# EAGLE design dc32sao (EAGLE 9.6.2)
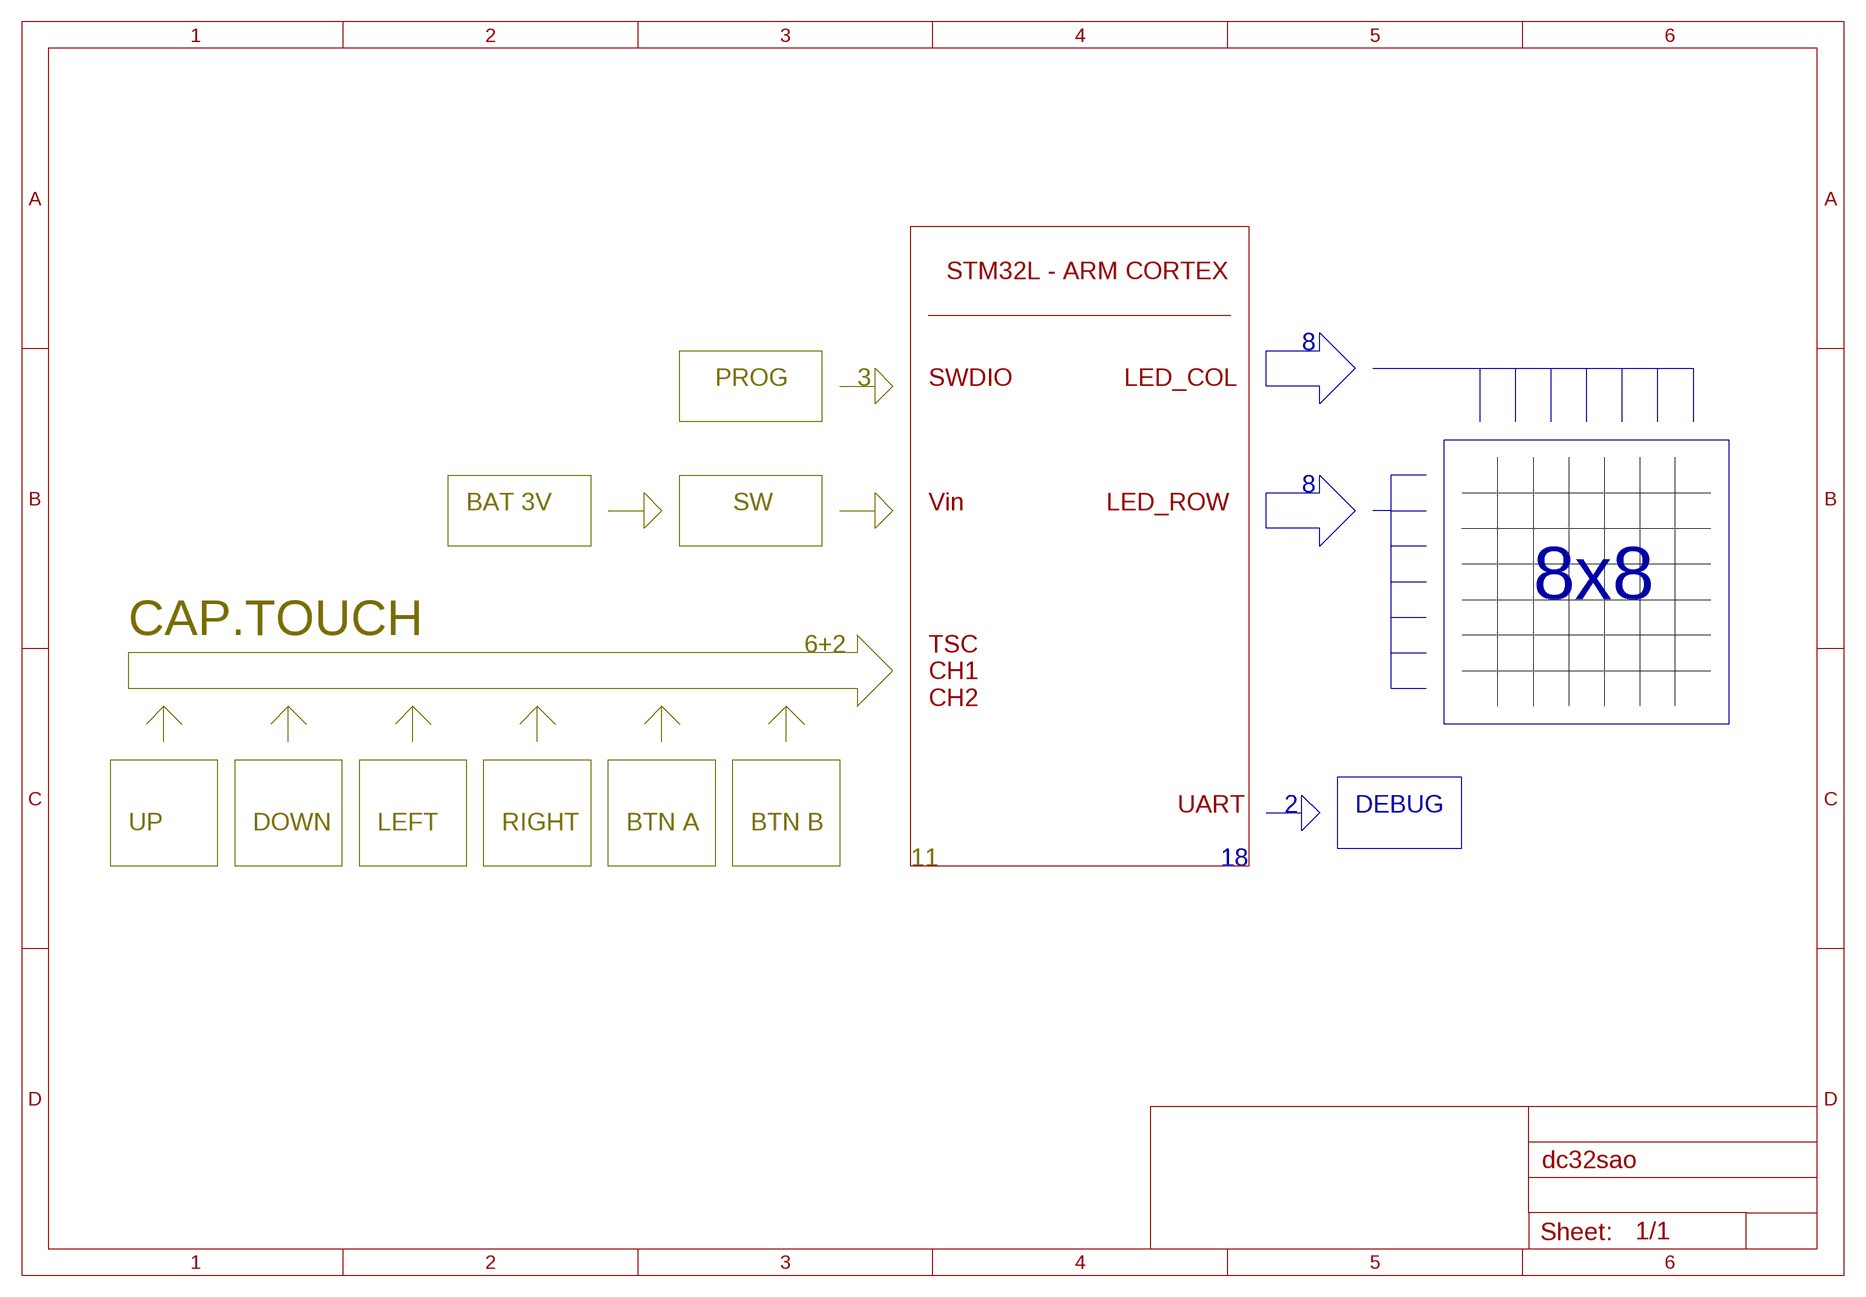
[diagram p0: schematic, sheet 1, part 1 of 2]
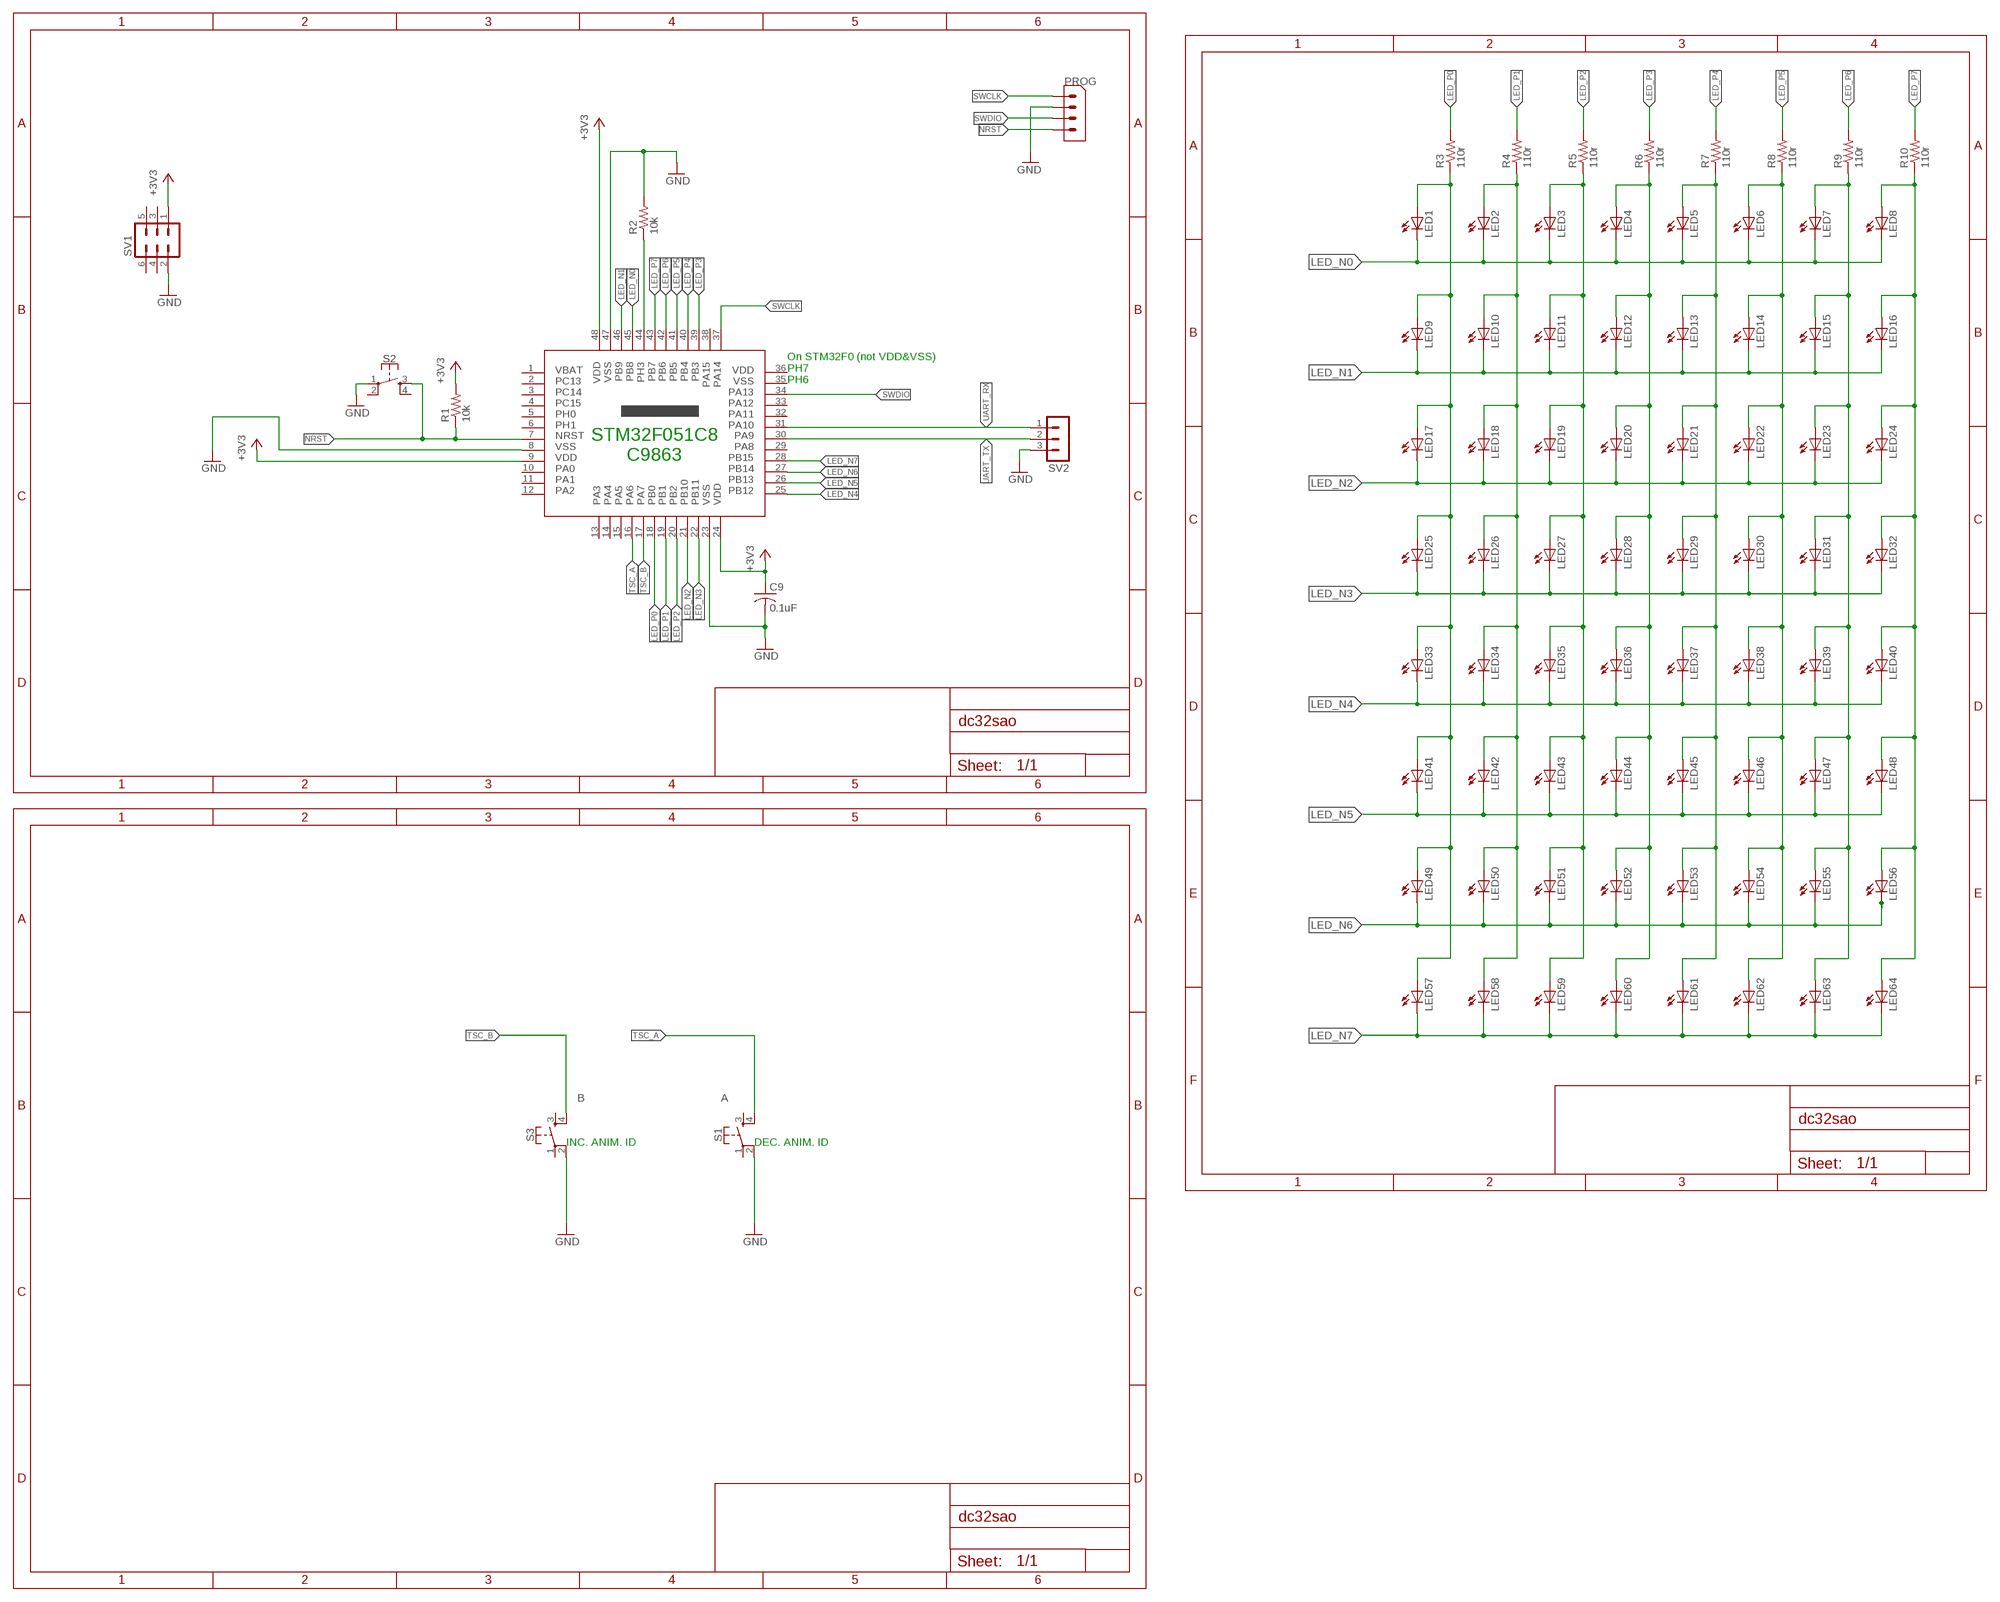
[diagram p1: schematic, sheet 1, part 2 of 2]

## Parts
C9  0.1uF  C-USC0603  [C0603]
LED1  LEDCHIP-LED0603  [CHIP-LED0603]
LED2  LEDCHIP-LED0603  [CHIP-LED0603]
LED3  LEDCHIP-LED0603  [CHIP-LED0603]
LED4  LEDCHIP-LED0603  [CHIP-LED0603]
LED5  LEDCHIP-LED0603  [CHIP-LED0603]
LED6  LEDCHIP-LED0603  [CHIP-LED0603]
LED7  LEDCHIP-LED0603  [CHIP-LED0603]
LED8  LEDCHIP-LED0603  [CHIP-LED0603]
LED9  LEDCHIP-LED0603  [CHIP-LED0603]
LED10  LEDCHIP-LED0603  [CHIP-LED0603]
LED11  LEDCHIP-LED0603  [CHIP-LED0603]
LED12  LEDCHIP-LED0603  [CHIP-LED0603]
LED13  LEDCHIP-LED0603  [CHIP-LED0603]
LED14  LEDCHIP-LED0603  [CHIP-LED0603]
LED15  LEDCHIP-LED0603  [CHIP-LED0603]
LED16  LEDCHIP-LED0603  [CHIP-LED0603]
LED17  LEDCHIP-LED0603  [CHIP-LED0603]
LED18  LEDCHIP-LED0603  [CHIP-LED0603]
LED19  LEDCHIP-LED0603  [CHIP-LED0603]
LED20  LEDCHIP-LED0603  [CHIP-LED0603]
LED21  LEDCHIP-LED0603  [CHIP-LED0603]
LED22  LEDCHIP-LED0603  [CHIP-LED0603]
LED23  LEDCHIP-LED0603  [CHIP-LED0603]
LED24  LEDCHIP-LED0603  [CHIP-LED0603]
LED25  LEDCHIP-LED0603  [CHIP-LED0603]
LED26  LEDCHIP-LED0603  [CHIP-LED0603]
LED27  LEDCHIP-LED0603  [CHIP-LED0603]
LED28  LEDCHIP-LED0603  [CHIP-LED0603]
LED29  LEDCHIP-LED0603  [CHIP-LED0603]
LED30  LEDCHIP-LED0603  [CHIP-LED0603]
LED31  LEDCHIP-LED0603  [CHIP-LED0603]
LED32  LEDCHIP-LED0603  [CHIP-LED0603]
LED33  LEDCHIP-LED0603  [CHIP-LED0603]
LED34  LEDCHIP-LED0603  [CHIP-LED0603]
LED35  LEDCHIP-LED0603  [CHIP-LED0603]
LED36  LEDCHIP-LED0603  [CHIP-LED0603]
LED37  LEDCHIP-LED0603  [CHIP-LED0603]
LED38  LEDCHIP-LED0603  [CHIP-LED0603]
LED39  LEDCHIP-LED0603  [CHIP-LED0603]
LED40  LEDCHIP-LED0603  [CHIP-LED0603]
LED41  LEDCHIP-LED0603  [CHIP-LED0603]
LED42  LEDCHIP-LED0603  [CHIP-LED0603]
LED43  LEDCHIP-LED0603  [CHIP-LED0603]
LED44  LEDCHIP-LED0603  [CHIP-LED0603]
LED45  LEDCHIP-LED0603  [CHIP-LED0603]
LED46  LEDCHIP-LED0603  [CHIP-LED0603]
LED47  LEDCHIP-LED0603  [CHIP-LED0603]
LED48  LEDCHIP-LED0603  [CHIP-LED0603]
LED49  LEDCHIP-LED0603  [CHIP-LED0603]
LED50  LEDCHIP-LED0603  [CHIP-LED0603]
LED51  LEDCHIP-LED0603  [CHIP-LED0603]
LED52  LEDCHIP-LED0603  [CHIP-LED0603]
LED53  LEDCHIP-LED0603  [CHIP-LED0603]
LED54  LEDCHIP-LED0603  [CHIP-LED0603]
LED55  LEDCHIP-LED0603  [CHIP-LED0603]
LED56  LEDCHIP-LED0603  [CHIP-LED0603]
LED57  LEDCHIP-LED0603  [CHIP-LED0603]
LED58  LEDCHIP-LED0603  [CHIP-LED0603]
LED59  LEDCHIP-LED0603  [CHIP-LED0603]
LED60  LEDCHIP-LED0603  [CHIP-LED0603]
LED61  LEDCHIP-LED0603  [CHIP-LED0603]
LED62  LEDCHIP-LED0603  [CHIP-LED0603]
LED63  LEDCHIP-LED0603  [CHIP-LED0603]
LED64  LEDCHIP-LED0603  [CHIP-LED0603]
PROG  4-PIN-1.25MM  [4-PIN-1.25MM]
R1  10k  R-US_R0603  [R0603]
R2  10k  R-US_R0603  [R0603]
R3  110r  R-US_R0603  [R0603]
R4  110r  R-US_R0603  [R0603]
R5  110r  R-US_R0603  [R0603]
R6  110r  R-US_R0603  [R0603]
R7  110r  R-US_R0603  [R0603]
R8  110r  R-US_R0603  [R0603]
R9  110r  R-US_R0603  [R0603]
R10  110r  R-US_R0603  [R0603]
S1  MOMENTARY-SWITCH-SPST-2-SMD-5.2MM  [TACTILE_SWITCH_SMD_5.2MM]
S2  MOMENTARY-SWITCH-SPST-2-SMD-5.2MM  [TACTILE_SWITCH_SMD_5.2MM]
S3  MOMENTARY-SWITCH-SPST-2-SMD-5.2MM  [TACTILE_SWITCH_SMD_5.2MM]
SV1  MA03-2  [MA03-2]
SV2  MA03-1  [MA03-1]
U$2  STM32L431CC  [QFP50P900X900X160-48]

## Nets
+3V3: C9.1 R1.2 SV1.1 U$2.9 U$2.24 U$2.48
GND: C9.2 PROG.P$3 R2.2 S1.2 S2.1 S3.2 SV1.2 SV2.3 U$2.8 U$2.23 U$2.47
LED_N0: LED1.C LED2.C LED3.C LED4.C LED5.C LED6.C LED7.C LED8.C U$2.45
LED_N1: LED9.C LED10.C LED11.C LED12.C LED13.C LED14.C LED15.C LED16.C U$2.46
LED_N2: LED17.C LED18.C LED19.C LED20.C LED21.C LED22.C LED23.C LED24.C U$2.21
LED_N3: LED25.C LED26.C LED27.C LED28.C LED29.C LED30.C LED31.C LED32.C U$2.22
LED_N4: LED33.C LED34.C LED35.C LED36.C LED37.C LED38.C LED39.C LED40.C U$2.25
LED_N5: LED41.C LED42.C LED43.C LED44.C LED45.C LED46.C LED47.C LED48.C U$2.26
LED_N6: LED49.C LED50.C LED51.C LED52.C LED53.C LED54.C LED55.C LED56.C U$2.27
LED_N7: LED57.C LED58.C LED59.C LED60.C LED61.C LED62.C LED63.C LED64.C U$2.28
LED_P0: R3.2 U$2.18
LED_P0B: LED1.A LED9.A LED17.A LED25.A LED33.A LED41.A LED49.A LED57.A R3.1
LED_P1: R4.2 U$2.19
LED_P1B: LED2.A LED10.A LED18.A LED26.A LED34.A LED42.A LED50.A LED58.A R4.1
LED_P2: R5.2 U$2.20
LED_P2B: LED3.A LED11.A LED19.A LED27.A LED35.A LED43.A LED51.A LED59.A R5.1
LED_P3: R6.2 U$2.39
LED_P3B: LED4.A LED12.A LED20.A LED28.A LED36.A LED44.A LED52.A LED60.A R6.1
LED_P4: R7.2 U$2.40
LED_P4B: LED5.A LED13.A LED21.A LED29.A LED37.A LED45.A LED53.A LED61.A R7.1
LED_P5: R8.2 U$2.41
LED_P5B: LED6.A LED14.A LED22.A LED30.A LED38.A LED46.A LED54.A LED62.A R8.1
LED_P6: R9.2 U$2.42
LED_P6B: LED7.A LED15.A LED23.A LED31.A LED39.A LED47.A LED55.A LED63.A R9.1
LED_P7: R10.2 U$2.43
LED_P7B: LED8.A LED16.A LED24.A LED32.A LED40.A LED48.A LED56.A LED64.A R10.1
N$6: R2.1 U$2.44
NRST: PROG.P$1 R1.1 S2.3 U$2.7
SWCLK: PROG.P$4 U$2.37
SWDIO: PROG.P$2 U$2.34
TSC_A: S1.4 U$2.16
TSC_B: S3.4 U$2.17
UART_RX: SV2.1 U$2.31
UART_TX: SV2.2 U$2.30
Unconnected: S1.1 S1.3 S2.2 S2.4 S3.1 S3.3 SV1.3 SV1.4 SV1.5 SV1.6 U$2.1 U$2.2 U$2.3 U$2.4 U$2.5 U$2.6 U$2.10 U$2.11 U$2.12 U$2.13 U$2.14 U$2.15 U$2.29 U$2.32 U$2.33 U$2.35 U$2.36 U$2.38

## Buses
B$1
B$2
B$3
B$4
B$5
B$7
B$6
B$8

## Notes on the sheet
- STM32L - ARM CORTEX
- 8
- PROG | 3 | SWDIO | LED_COL
- 8
- BAT 3V | SW | Vin | LED_ROW
- 8x8
- On STM32F0 (not VDD&VSS)
  PH7
  PH6
- CAP.TOUCH
- 6+2
- TSC 
  CH1
  CH2
- STM32F051C8
  C9863
- UART | 2 | DEBUG
- UP | DOWN | LEFT | RIGHT | BTN A | BTN B
- 11 | 18
- B | A
- INC. ANIM. ID | DEC. ANIM. ID

## Library data of the parts
C9 = rcl:C-US: CAPACITOR, American symbol; SPICEPREFIX: C
LED1-LED64 = adafruit:LED: LED OSRAM: - CHIPLED LG R971, LG N971, LY N971, LG Q971, LY Q971, LO R971, LY R971 LH N974, LH R974 LS Q976, LO Q976, LY Q976 LO Q996 - Hyper CHIPLED LW Q18S LB Q993, LB Q99A, LB R99A - SideLED LS A670, LO A670, LY A670, LG A670, LP A670 LB A673, LV A673, LT A673, LW A673 LH A674 LY A675 LS A676, LA A676, LO A676, LY A676, LW A676 LS A679, LY A679, LG A679 - Hyper Micro SIDELED® LS Y876, LA Y876, LO Y876, LY Y876 LT Y87S - SmartLED LW L88C, LW L88S LB L89C, LB L89S, LG L890 LS L89K, LO L89K, LY L89K LS L896, LA L896, LO L896, LY L896 - TOPLED LS T670, LO T670, LY T670, LG T670, LP T670 LSG T670, LSP T670, LSY T670, LOP T670, LYG T670 LG T671, LOG T671, LSG T671 LB T673, LV T673, LT T673, LW T673 LH T674 LS T676, LA T676, LO T676, LY T676, LB T676, LH T676, LSB T676, LW T676 LB T67C, LV T67C, LT T67C, LS T67K, LO T67K, LY T67K, LW E67C LS E67B, LA E67B, LO E67B, LY E67B, LB E67C, LV E67C, LT E67C LW T67C LS T679, LY T679, LG T679 LS T770, LO T770, LY T770, LG T770, LP T770 LB T773, LV T773, LT T773, LW T773 LH T774 LS E675, LA E675, LY E675, LS T675 LS T776, LA T776, LO T776, LY T776, LB T776 LHGB T686 LT T68C, LB T68C - Hyper Mini TOPLED® LB M676 - Mini TOPLED Santana® LG M470 LS M47K, LO M47K, LY M47K Source: http://www.osram.convergy.de/
PROG = Wingling Library:4-PIN-1.25MM
R1-R10 = rcl:R-US_: RESISTOR, American symbol; SPICEPREFIX: R
S1-S3 = SparkFun-Switches:MOMENTARY-SWITCH-SPST-2: Momentary Switch (Pushbutton) - SPST - Two Circuits Normally-open (NO) SPST momentary switches (buttons, pushbuttons). Schematic symbol includes two switch circuits. Variants SMD-4.6MMX2.8MM - 4.60mm x 2.80mm Tactile Momentary Button Switch - Used on SparkFun SAMD21 Mini Breakout <https://www.sparkfun.com/products/13664> SMD-5.2MM - Mini Pushbutton Switch - SMD <https://www.sparkfun.com/products/8720> - Used on Arduino Pro Mini <https://www.sparkfun.com/products/11114>; PROD_ID: SWCH-08247; SF_SKU: COM-08720
SV1 = con-lstb:MA03-2: PIN HEADER; OC_FARNELL: unknown; OC_NEWARK: unknown
SV2 = con-lstb:MA03-1: PIN HEADER; OC_FARNELL: unknown; OC_NEWARK: unknown
U$2 = prankbox:STM32L431CC

## Board
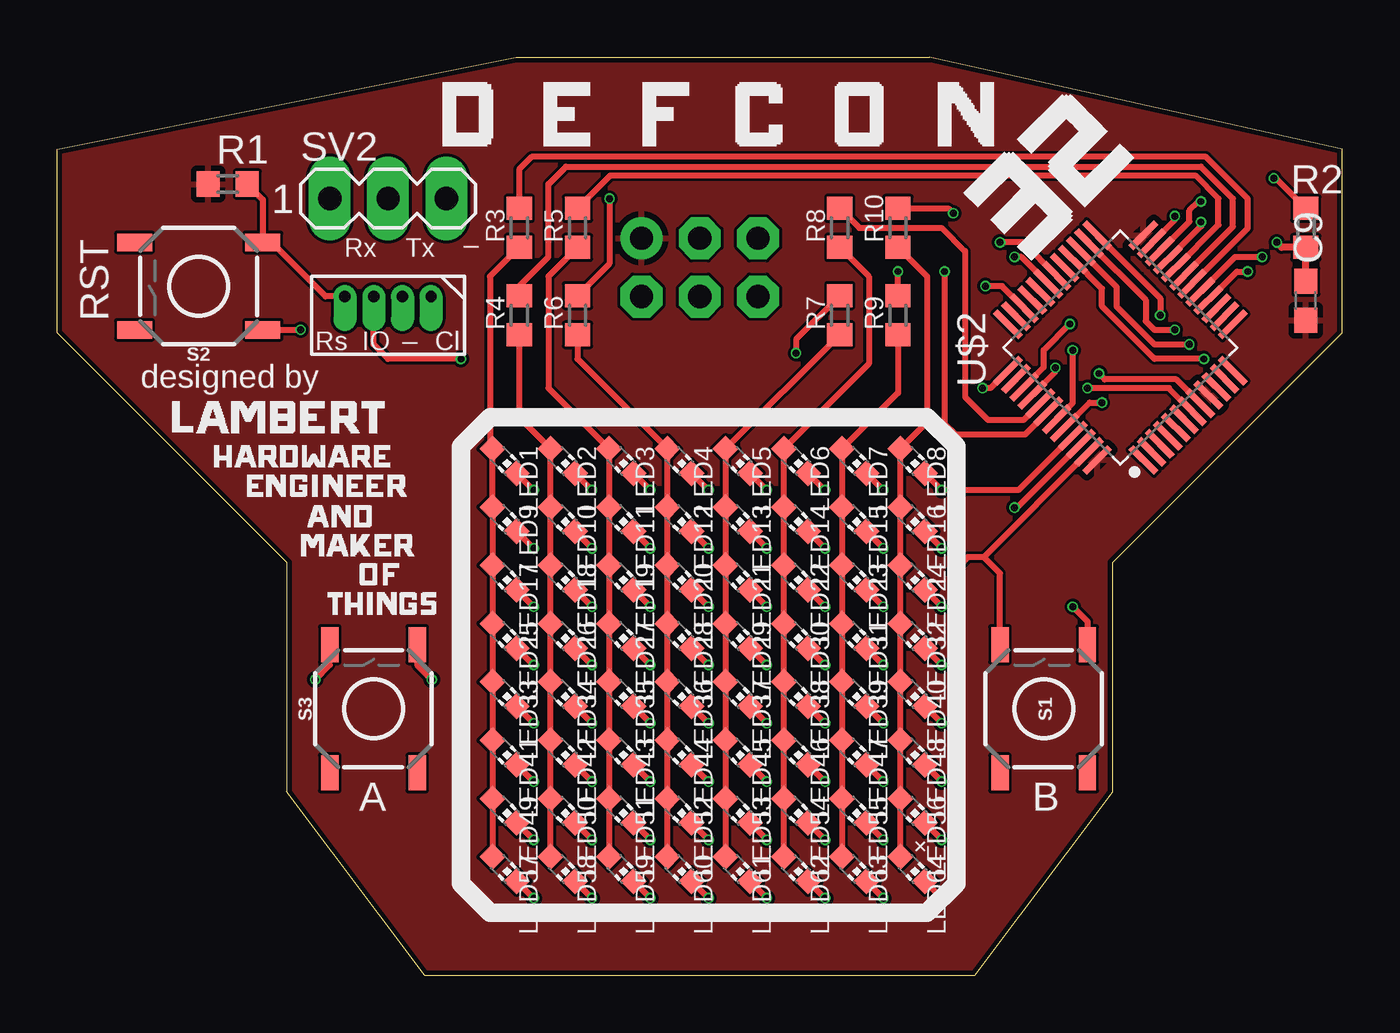
[diagram p2: board, top side]
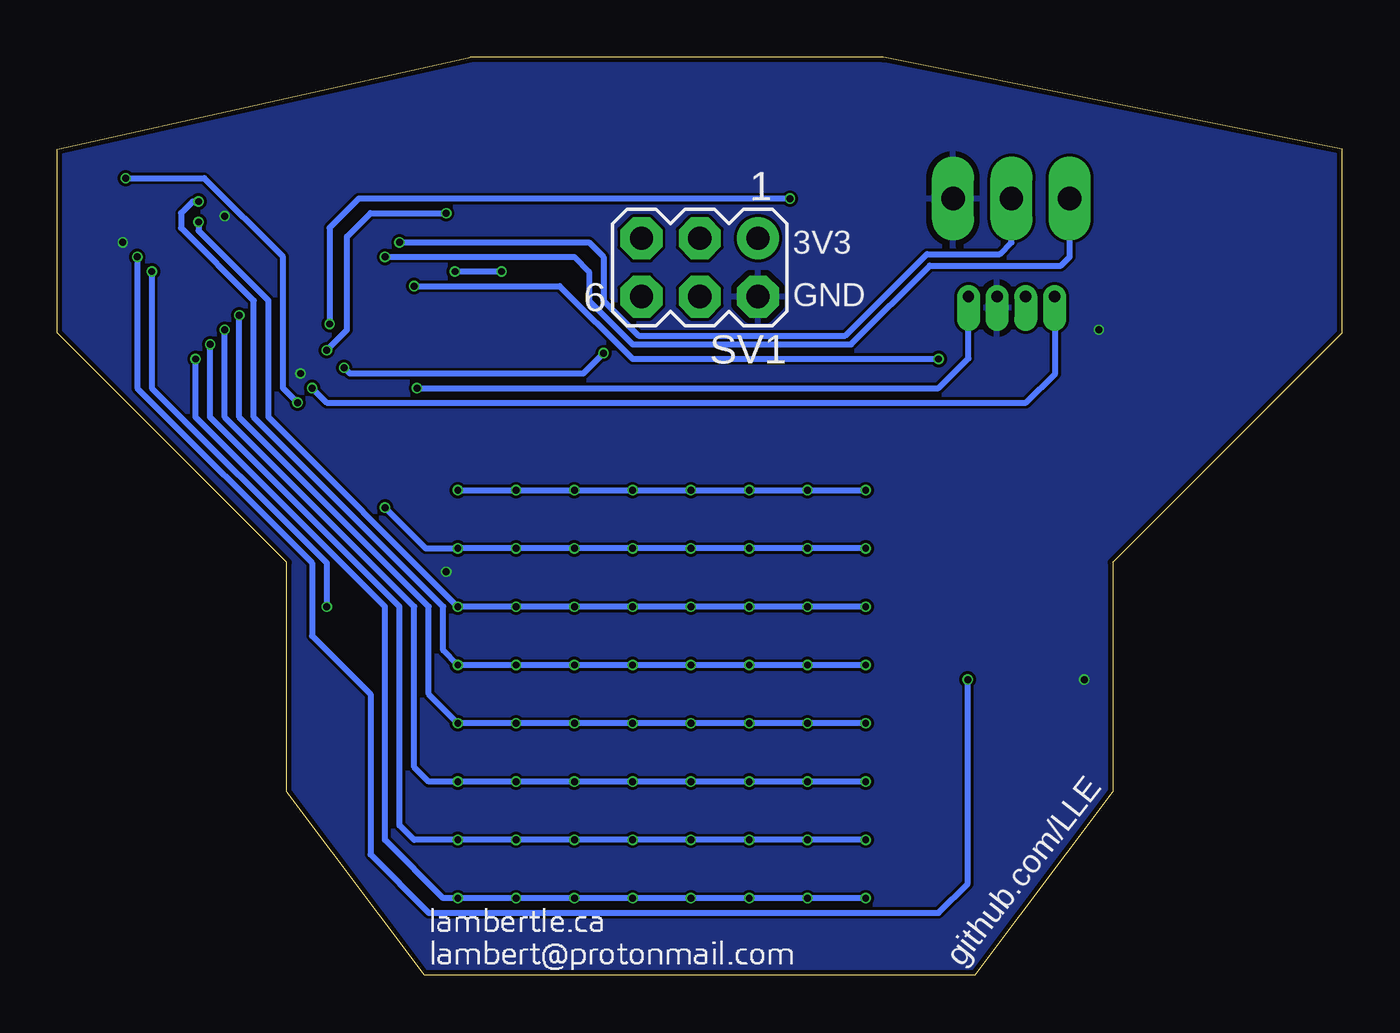
[diagram p3: board, bottom side, seen from below]

Size 56 x 40 mm. Coordinates in mm from the lower left corner, seen from the top.
Outline: 46,8 46,18 56,28 56,36 38,40 20,40 0,36 0,28 10,18 10,8 16,0 40,0 46,8
Copper layers (1*16): Top 0.035mm / dielectric 1.6mm / Bottom 0.035mm
Design rules "jlcpcb-2layers": minimum track width 5mil, minimum drill 0.3mm, track to track 5mil, track to pad 5mil, pad to pad 5mil, via to via 5mil, smd to smd 5mil, copper to edge 0.2mm, drill to drill 6mil, minimum pad ring 10mil, minimum via ring 3mil, stop-mask expansion 4mil, vias tented up to drill 0mil, thermal gap 10mil

### Footprints (pad centres in the part's own frame; a part is rotated, then mirrored left to right if it is on the bottom)
C0603 = smd 1.1 x 1: 1 -0.85,0; 2 0.85,0
CHIP-LED0603 = smd 0.8 x 0.8: A 0,-0.75; C 0,0.75
4-PIN-1.25MM = drill 0.5 offset: P$1 -1.875,0.82; P$2 -0.625,0.82; P$3 0.625,0.82; P$4 1.875,0.82
R0603 = smd 1 x 1.1: 1 -0.85,0; 2 0.85,0
TACTILE_SWITCH_SMD_5.2MM = smd 1.524 x 0.762: 1 -2.794,1.905; 2 2.794,1.905; 3 -2.794,-1.905; 4 2.794,-1.905
MA03-2 = drill 1.016: 1 -2.54,-1.27 | drill 1.016 octagon: 2 -2.54,1.27; 3 0,-1.27; 4 0,1.27; 5 2.54,-1.27; 6 2.54,1.27
MA03-1 = drill 1.016 long: 1 -2.54,0; 2 0,0; 3 2.54,0
QFP50P900X900X160-48 = smd 1.559 x 0.28: 1 -4.178,2.75; 2 -4.178,2.25; 3 -4.178,1.75; 4 -4.178,1.25; 5 -4.178,0.75; 6 -4.178,0.25; 7 -4.178,-0.25; 8 -4.178,-0.75; 9 -4.178,-1.25; 10 -4.178,-1.75; 11 -4.178,-2.25; 12 -4.178,-2.75; 25 4.178,-2.75; 26 4.178,-2.25; 27 4.178,-1.75; 28 4.178,-1.25; 29 4.178,-0.75; 30 4.178,-0.25; 31 4.178,0.25; 32 4.178,0.75; 33 4.178,1.25; 34 4.178,1.75; 35 4.178,2.25; 36 4.178,2.75 | smd 0.28 x 1.559: 13 -2.75,-4.178; 14 -2.25,-4.178; 15 -1.75,-4.178; 16 -1.25,-4.178; 17 -0.75,-4.178; 18 -0.25,-4.178; 19 0.25,-4.178; 20 0.75,-4.178; 21 1.25,-4.178; 22 1.75,-4.178; 23 2.25,-4.178; 24 2.75,-4.178; 37 2.75,4.178; 38 2.25,4.178; 39 1.75,4.178; 40 1.25,4.178; 41 0.75,4.178; 42 0.25,4.178; 43 -0.25,4.178; 44 -0.75,4.178; 45 -1.25,4.178; 46 -1.75,4.178; 47 -2.25,4.178; 48 -2.75,4.178

### Placement (x,y rotation side)
C9  54.42,29.4 90 top
LED1  19.5,22.41 225 top
LED2  22.04,22.41 225 top
LED3  24.57,22.41 225 top
LED4  27.11,22.41 225 top
LED5  29.66,22.41 225 top
LED6  32.2,22.41 225 top
LED7  34.73,22.41 225 top
LED8  37.27,22.41 225 top
LED9  19.5,19.88 225 top
LED10  22.04,19.88 225 top
LED11  24.57,19.88 225 top
LED12  27.11,19.88 225 top
LED13  29.66,19.88 225 top
LED14  32.2,19.88 225 top
LED15  34.73,19.88 225 top
LED16  37.27,19.88 225 top
LED17  19.5,17.34 225 top
LED18  22.04,17.34 225 top
LED19  24.57,17.34 225 top
LED20  27.11,17.34 225 top
LED21  29.66,17.34 225 top
LED22  32.2,17.34 225 top
LED23  34.73,17.34 225 top
LED24  37.27,17.34 225 top
LED25  19.5,14.79 225 top
LED26  22.04,14.79 225 top
LED27  24.57,14.79 225 top
LED28  27.11,14.79 225 top
LED29  29.66,14.79 225 top
LED30  32.2,14.79 225 top
LED31  34.73,14.79 225 top
LED32  37.27,14.79 225 top
LED33  19.5,12.26 225 top
LED34  22.04,12.26 225 top
LED35  24.57,12.26 225 top
LED36  27.11,12.26 225 top
LED37  29.66,12.26 225 top
LED38  32.2,12.26 225 top
LED39  34.73,12.26 225 top
LED40  37.27,12.26 225 top
LED41  19.5,9.71 225 top
LED42  22.04,9.71 225 top
LED43  24.57,9.71 225 top
LED44  27.11,9.71 225 top
LED45  29.66,9.71 225 top
LED46  32.2,9.71 225 top
LED47  34.73,9.71 225 top
LED48  37.27,9.71 225 top
LED49  19.5,7.17 225 top
LED50  22.04,7.17 225 top
LED51  24.57,7.17 225 top
LED52  27.11,7.17 225 top
LED53  29.66,7.17 225 top
LED54  32.2,7.17 225 top
LED55  34.73,7.17 225 top
LED56  37.27,7.17 225 top
LED57  19.5,4.63 225 top
LED58  22.04,4.63 225 top
LED59  24.57,4.63 225 top
LED60  27.11,4.63 225 top
LED61  29.66,4.63 225 top
LED62  32.2,4.63 225 top
LED63  34.73,4.63 225 top
LED64  37.27,4.63 225 top
PROG  14.41,28.77 0 top
R1  7.43,34.48 180 top
R2  54.42,32.58 270 top
R3  20.13,32.58 90 top
R4  20.13,28.77 90 top
R5  22.67,32.58 90 top
R6  22.67,28.77 90 top
R7  34.1,28.77 90 top
R8  34.1,32.58 90 top
R9  36.64,28.77 90 top
R10  36.64,32.58 90 top
S1  42.99,11.62 90 top
S2  6.16,30.04 180 top
S3  13.78,11.62 90 top
SV1  28,30.85 180 bottom
SV2  14.41,33.84 0 top
U$2  46.33,27.36 135 top

### Tracks (layer width: path | path; a pad name or v marks a point on that pad's centre or on a via)
+3V3
  pour Top: -4,42.1 59.5,42.1 59.5,-3.62 -4,-3.62
GND  (via drill 0.3)
  Top 0.254: S2.1 v10.61,28.13 | v11.24,12.89 11.88,13.53 S3.2 | U$2.23 48.7,32.91 v48.7,33.08 | 40.38,18.22 39.69,18.22 v39.05,17.59 | U$2.8 48.78,25.97 45.66,25.97 v45.4,26.23 | U$2.47 40.38,18.22 | S1.2 41.09,17.52 40.38,18.22 | S3.2
  Top 0.305: C9.2 R2.2 53.37,31.73 v53.15,31.94
  pour Bottom: -1.46,41.47 56.96,41.47 56.96,-1.08 -1.46,-1.08
LED_N0  (via drill 0.3)
  Top 0.254: LED8.C | LED8.C v38.55,21.14 41.89,21.14 U$2.45 | LED1.C | LED1.C v20.77,21.14 | LED2.C | LED2.C v23.3,21.14 | LED3.C v25.84,21.14 | v25.84,21.14 | LED4.C | LED4.C v28.38,21.14 | LED5.C v30.92,21.14 | v30.92,21.14 | LED6.C v33.47,21.14 | v33.47,21.14 | LED7.C | LED7.C v36.01,21.14
  Bottom 0.254: v38.55,21.14 v36.01,21.14 v33.47,21.14 v30.92,21.14 v28.38,21.14 v25.84,21.14 v23.3,21.14 v20.77,21.14
LED_N1  (via drill 0.3)
  Top 0.254: LED9.C v20.77,18.61 | v20.77,18.61 | LED10.C | LED10.C v23.3,18.61 | LED11.C v25.84,18.61 | v25.84,18.61 | LED12.C | LED12.C v28.38,18.61 | LED13.C | LED13.C v30.92,18.61 | LED14.C | LED14.C v33.47,18.61 | LED15.C | LED15.C v36.01,18.61 | LED16.C v38.55,18.61 | v38.55,18.61 | v41.72,20.38 41.83,20.38 U$2.46
  Bottom 0.254: v20.77,18.61 v23.3,18.61 v25.84,18.61 v28.38,18.61 v30.92,18.61 v33.47,18.61 v36.01,18.61 v38.55,18.61 39.94,18.61 v41.72,20.38
LED_N2  (via drill 0.3)
  Top 0.254: LED17.C v20.77,16.06 | v20.77,16.06 | U$2.21 49.85,32.64 v49.85,32.83 | LED18.C v23.3,16.06 | v23.3,16.06 | LED19.C v25.84,16.06 | v25.84,16.06 | LED20.C | LED20.C v28.38,16.06 | LED22.C | LED22.C v33.47,16.06 | LED21.C v30.92,16.06 | v30.92,16.06 | LED23.C v36.01,16.06 | v36.01,16.06 | LED24.C v38.55,16.06 | v38.55,16.06
  Bottom 0.254: v20.77,16.06 v23.3,16.06 v25.84,16.06 v28.38,16.06 v30.92,16.06 v33.47,16.06 v36.01,16.06 v38.55,16.06 46.8,24.32 46.8,29.4 49.85,32.45 v49.85,32.83
LED_N3  (via drill 0.3)
  Top 0.254: LED25.C v20.77,13.53 | v20.77,13.53 | U$2.22 49.34,32.84 49.34,33.34 49.72,33.72 v49.85,33.72 | LED26.C | LED26.C v23.3,13.53 | LED27.C v25.84,13.53 | v25.84,13.53 | LED28.C | LED28.C v28.38,13.53 | LED29.C v30.92,13.53 | v30.92,13.53 | LED31.C | LED31.C v36.01,13.53 | LED30.C | LED30.C v33.47,13.53 | LED32.C | LED32.C v38.55,13.53
  Bottom 0.254: v20.77,13.53 v23.3,13.53 v25.84,13.53 v28.38,13.53 v30.92,13.53 v33.47,13.53 v36.01,13.53 v38.55,13.53 39.18,14.16 39.18,16.06 47.44,24.32 47.44,29.4 50.61,32.58 50.61,33.21 50.1,33.72 v49.85,33.72
LED_N4  (via drill 0.3)
  Top 0.254: LED33.C v20.77,10.98 | v20.77,10.98 | U$2.25 48.07,29.51 v48.07,28.77 | LED34.C | LED34.C v23.3,10.98 | LED35.C v25.84,10.98 | v25.84,10.98 | LED36.C | LED36.C v28.38,10.98 | LED37.C | LED37.C v30.92,10.98 | LED38.C | LED38.C v33.47,10.98 | LED39.C v36.01,10.98 | v36.01,10.98 | LED40.C | LED40.C v38.55,10.98
  Bottom 0.254: v20.77,10.98 v23.3,10.98 v25.84,10.98 v28.38,10.98 v30.92,10.98 v33.47,10.98 v36.01,10.98 v38.55,10.98 39.81,12.26 39.81,16.06 48.07,24.32 v48.07,28.77
LED_N5  (via drill 0.3)
  Top 0.254: LED41.C v20.77,8.45 | v20.77,8.45 | U$2.26 47.44,29.43 47.44,28.51 47.82,28.13 v48.7,28.13 | LED48.C v38.55,8.45 | v38.55,8.45 | LED47.C | LED47.C v36.01,8.45 | LED46.C v33.47,8.45 | v33.47,8.45 | LED45.C | LED45.C v30.92,8.45 | LED44.C v28.38,8.45 | v28.38,8.45 | LED43.C v25.84,8.45 | v25.84,8.45 | LED42.C v23.3,8.45 | v23.3,8.45
  Bottom 0.254: v48.7,28.13 48.7,24.32 40.45,16.06 40.45,9.08 39.81,8.45 v38.55,8.45 v36.01,8.45 v33.47,8.45 v30.92,8.45 v28.38,8.45 v25.84,8.45 v23.3,8.45 v20.77,8.45
LED_N6  (via drill 0.3)
  Top 0.254: LED49.C | LED49.C v20.77,5.91 | U$2.27 46.16,30 46.16,29.15 47.82,27.5 v49.34,27.5 | LED50.C | LED50.C v23.3,5.91 | LED51.C | LED51.C v25.84,5.91 | LED52.C v28.38,5.91 | v28.38,5.91 | LED53.C v30.92,5.91 | v30.92,5.91 | LED54.C | LED54.C v33.47,5.91 | LED55.C v36.01,5.91 | v36.01,5.91 | LED56.C v38.55,5.91 | v38.55,5.91
  Bottom 0.254: v20.77,5.91 v23.3,5.91 v25.84,5.91 v28.38,5.91 v30.92,5.91 v33.47,5.91 v36.01,5.91 v38.55,5.91 40.45,5.91 41.09,6.54 41.09,16.06 49.34,24.32 v49.34,27.5
LED_N7  (via drill 0.3)
  Top 0.254: LED57.C v20.77,3.37 | v20.77,3.37 | v49.98,26.86 47.82,26.86 45.53,29.15 45.53,29.93 U$2.28 | LED64.C v38.55,3.37 | v38.55,3.37 | LED63.C v36.01,3.37 | v36.01,3.37 | LED62.C v33.47,3.37 | v33.47,3.37 | LED61.C | LED61.C v30.92,3.37 | LED60.C | LED60.C v28.38,3.37 | LED59.C | LED59.C v25.84,3.37 | LED58.C | LED58.C v23.3,3.37
  Bottom 0.254: v20.77,3.37 v23.3,3.37 v25.84,3.37 v28.38,3.37 v30.92,3.37 v33.47,3.37 v36.01,3.37 v38.55,3.37 39.18,3.37 41.72,5.91 41.72,16.06 49.98,24.32 v49.98,26.86
LED_P0
  Top 0.254: U$2.18 51.88,32.55 51.88,33.84 50.06,35.66 20.68,35.66 20.13,35.11 R3.2
LED_P0B
  Top 0.254: R3.1 18.86,30.45 18.86,23.05 LED1.A LED9.A 18.96,17.97 LED17.A LED25.A LED33.A LED41.A LED49.A LED57.A
LED_P1
  Top 0.254: U$2.19 51.24,32.62 51.24,33.84 49.85,35.24 22.16,35.24 21.4,34.48 21.4,31.3 20.13,30.04 R4.2
LED_P1B
  Top 0.254: R4.1 20.13,24.32 LED2.A LED10.A LED18.A LED26.A 21.5,12.89 LED34.A LED42.A LED50.A LED58.A
LED_P2
  Top 0.254: U$2.20 50.61,32.7 50.61,33.84 49.59,34.86 24.11,34.86 R5.2
LED_P2B
  Top 0.254: R5.1 21.4,30.45 21.4,25.59 LED3.A 24.05,20.51 LED11.A LED19.A LED27.A LED35.A LED43.A LED51.A LED59.A
LED_P3  (via drill 0.3)
  Top 0.254: U$2.39 42.99,26.49 42.99,27.24 v44.13,28.38 | v24.07,33.84 24.07,31.01 R6.2
  Bottom 0.254: v24.07,33.84 42.86,33.84 44.13,32.58 v44.13,28.38
LED_P3B
  Top 0.254: R6.1 22.67,26.86 LED4.A LED12.A LED20.A LED28.A 26.59,12.89 LED36.A LED44.A LED52.A LED60.A
LED_P4  (via drill 0.3)
  Top 0.254: U$2.40 43.5,26.29 v43.5,26.48 | R7.2 32.2,27.71 v32.2,27.11
  Bottom 0.254: v32.2,27.11 33.08,26.23 43.24,26.23 v43.5,26.48
LED_P4B
  Top 0.254: R7.1 LED5.A LED13.A LED21.A LED29.A LED37.A 29.12,10.35 LED45.A LED53.A LED61.A
LED_P5
  Top 0.254: U$2.41 42.11,24.19 40.58,24.19 39.56,25.21 39.56,31.56 38.55,32.58 34.95,32.58 R8.2
LED_P5B
  Top 0.254: R8.1 35.37,30.45 35.37,26.65 LED6.A LED14.A LED22.A LED30.A LED38.A LED46.A 31.66,7.81 LED54.A LED62.A
LED_P6  (via drill 0.3)
  Top 0.254: U$2.42 42.18,23.56 39.18,23.56 38.67,24.07 v38.67,30.67 | R9.2 v36.64,30.67
  Bottom 0.254: v36.64,30.67 v38.67,30.67
LED_P6B
  Top 0.254: R9.1 36.64,25.38 LED7.A 34.2,20.51 LED15.A LED23.A LED31.A LED39.A LED47.A LED55.A LED63.A
LED_P7  (via drill 0.3)
  Top 0.254: U$2.43 44.26,24.93 v44.26,27.24 | R10.2 38.84,33.42 v39.05,33.21
  Bottom 0.254: v44.26,27.24 43.37,28.13 43.37,32.19 42.35,33.21 v39.05,33.21
LED_P7B
  Top 0.254: R10.1 37.91,30.45 37.91,24.11 LED8.A LED16.A LED24.A LED32.A LED40.A LED48.A 36.74,7.81 LED56.A LED64.A
N$6  (via drill 0.3)
  Top 0.254: U$2.44 44.99,24.95 v45.53,24.95 | R2.1 53.11,34.73 v53.02,34.73
  Bottom 0.254: v45.53,24.95 46.16,25.59 46.16,31.3 49.59,34.73 v53.02,34.73
NRST  (via drill 0.3)
  Top 0.254: R1.1 8.95,33.81 S2.3 9.34,31.94 11.69,29.59 PROG.P$1 | U$2.7 48.45,25.59 v44.9,25.59
  Bottom 0.254: v44.9,25.59 44.26,24.95 13.78,24.95 12.51,26.23 12.51,29.55 PROG.P$1
SWCLK  (via drill 0.3)
  Top 0.254: U$2.37 40.67,25.59 v40.32,25.59
  Bottom 0.254: v40.32,25.59 17.59,25.59 16.29,26.89 PROG.P$4
SWDIO  (via drill 0.3)
  Top 0.254: U$2.34 41.18,30.04 v40.45,30.04 | v17.59,26.86 14.41,26.86 13.78,27.5 13.78,29.57 PROG.P$2
  Bottom 0.254: v17.59,26.86 30.92,26.86 34.1,30.04 v40.45,30.04
TSC_A  (via drill 0.3)
  Top 0.254: U$2.16 51.41,30.67 v51.88,30.67 | v44.26,16.06 44.9,15.43 S1.4
  Bottom 0.254: v51.88,30.67 51.88,25.59 44.26,17.97 v44.26,16.06
TSC_B  (via drill 0.3)
  Top 0.254: v16.32,12.89 15.68,13.53 S3.4 | U$2.17 51.34,31.3 v52.52,31.3
  Bottom 0.254: v52.52,31.3 52.52,25.59 44.9,17.97 44.9,14.79 42.35,12.26 42.35,5.27 39.81,2.73 17.59,2.73 16.32,4 v16.32,12.89
UART_RX  (via drill 0.3)
  Top 0.254: U$2.31 42.03,31.3 v41.72,31.3
  Bottom 0.254: SV2.1 11.88,31.3 12.26,30.92 17.97,30.92 21.4,27.5 30.92,27.5 32.83,29.4 32.83,30.67 33.47,31.3 v41.72,31.3
UART_TX  (via drill 0.3)
  Top 0.254: U$2.30 42.1,31.94 v41.09,31.94
  Bottom 0.254: SV2.2 14.41,31.94 14.92,31.43 18.1,31.43 21.65,27.88 30.67,27.88 32.2,29.4 32.2,31.3 32.83,31.94 v41.09,31.94

### Text on the board
tPlace: _ | Rx | Tx | RST | _ | Rs | IO | Cl | designed by | A | B | - +
bNames: 3V3 | GND | github.com/LLE